# Altium schematic sheet 20210515-F103CONTROL.SchDoc
size A2
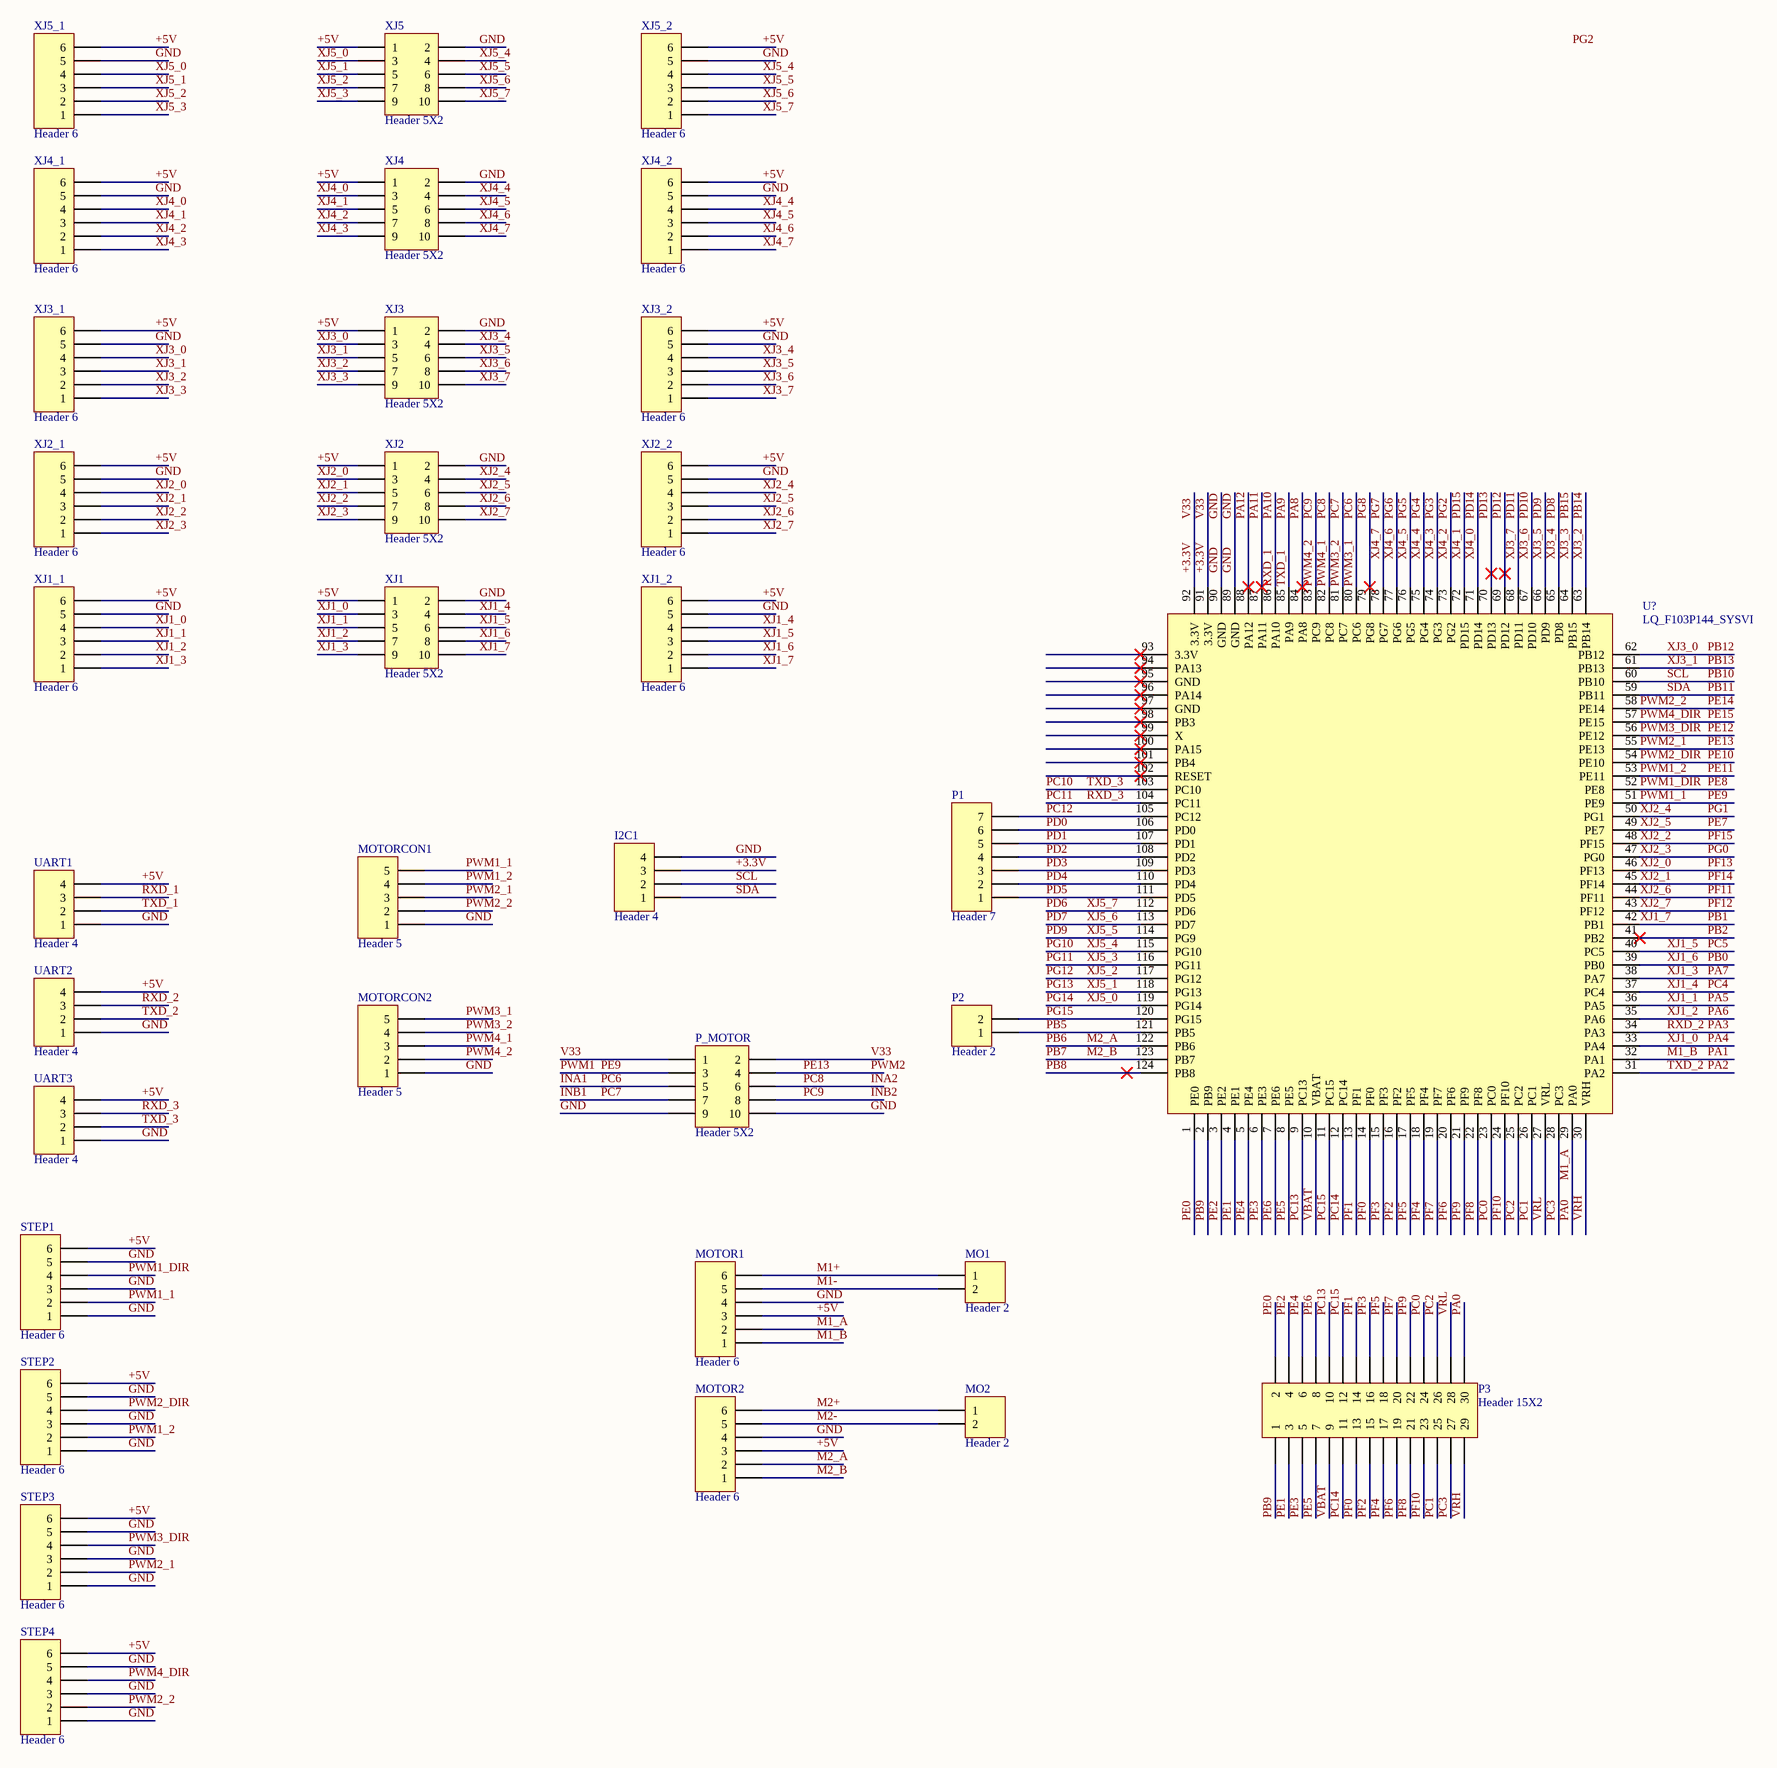
[diagram p0: 20210515-F103CONTROL.SchDoc]

## Parts
I2C1  Header 4  [HDR1X4]
MO1  Header 2  [XH2/2.54mm/180]
MO2  Header 2  [XH2/2.54mm/180]
MOTOR1  Header 6  [HDR1X6]
MOTOR2  Header 6  [HDR1X6]
MOTORCON1  Header 5  [HDR1X5]
MOTORCON2  Header 5  [HDR1X5]
P1  Header 7  [HDR1X7]
P2  Header 2  [HDR1X2]
P3  Header 15X2  [HDR2X15]
P_MOTOR  Header 5X2  [HDR2X5]
STEP1  Header 6  [XH6/2.54mm/180]
STEP2  Header 6  [XH6/2.54mm/180]
STEP3  Header 6  [XH6/2.54mm/180]
STEP4  Header 6  [XH6/2.54mm/180]
U?  LQ_F103P144_SYSVI  [LQ_F103P144_SYSVI]
UART1  Header 4  [XH4/2.54mm/180]
UART2  Header 4  [XH4/2.54mm/180]
UART3  Header 4  [XH4/2.54mm/180]
XJ1  Header 5X2  [HDR2X5]
XJ1_1  Header 6  [PH2.0-6P]
XJ1_2  Header 6  [PH2.0-6P]
XJ2  Header 5X2  [HDR2X5]
XJ2_1  Header 6  [PH2.0-6P]
XJ2_2  Header 6  [PH2.0-6P]
XJ3  Header 5X2  [HDR2X5]
XJ3_1  Header 6  [PH2.0-6P]
XJ3_2  Header 6  [PH2.0-6P]
XJ4  Header 5X2  [HDR2X5]
XJ4_1  Header 6  [PH2.0-6P]
XJ4_2  Header 6  [PH2.0-6P]
XJ5  Header 5X2  [HDR2X5]
XJ5_1  Header 6  [PH2.0-6P]
XJ5_2  Header 6  [PH2.0-6P]

## Nets
+3.3V: I2C1.3 P_MOTOR.1 P_MOTOR.2 U?.91(3.3V) U?.92(3.3V)  [also labelled V33]
+5V: MOTOR1.3 MOTOR2.3 STEP1.6 STEP2.6 STEP3.6 STEP4.6 UART1.4 UART2.4 UART3.4 XJ1.1 XJ1_1.6 XJ1_2.6 XJ2.1 XJ2_1.6 XJ2_2.6 XJ3.1 XJ3_1.6 XJ3_2.6 XJ4.1 XJ4_1.6 XJ4_2.6 XJ5.1 XJ5_1.6 XJ5_2.6
GND: I2C1.4 MOTOR1.4 MOTOR2.4 MOTORCON1.1 MOTORCON2.1 P_MOTOR.9 P_MOTOR.10 STEP1.1 STEP1.3 STEP1.5 STEP2.1 STEP2.3 STEP2.5 STEP3.1 STEP3.3 STEP3.5 STEP4.1 STEP4.3 STEP4.5 U?.89(GND) U?.90(GND) UART1.1 UART2.1 UART3.1 XJ1.2 XJ1_1.5 XJ1_2.5 XJ2.2 XJ2_1.5 XJ2_2.5 XJ3.2 XJ3_1.5 XJ3_2.5 XJ4.2 XJ4_1.5 XJ4_2.5 XJ5.2 XJ5_1.5 XJ5_2.5
INA1: MOTORCON2.5 P_MOTOR.5 U?.80(PC6)  [also labelled PC6, PWM3_1]
INA2: MOTORCON2.3 P_MOTOR.6 U?.82(PC8)  [also labelled PC8, PWM4_1]
INB1: MOTORCON2.4 P_MOTOR.7 U?.81(PC7)  [also labelled PC7, PWM3_2]
INB2: MOTORCON2.2 P_MOTOR.8 U?.83(PC9)  [also labelled PC9, PWM4_2]
M1+: MO1.1 MOTOR1.6
M1-: MO1.2 MOTOR1.5
M1_A: MOTOR1.2 P3.30 U?.29(PA0)  [also labelled PA0]
M1_B: MOTOR1.1 U?.32(PA1)  [also labelled PA1]
M2+: MO2.1 MOTOR2.6
M2-: MO2.2 MOTOR2.5
M2_A: MOTOR2.2 U?.122(PB6)  [also labelled PB6]
M2_B: MOTOR2.1 U?.123(PB7)  [also labelled PB7]
PA2: U?.31(PA2) UART2.2  [also labelled TXD_2]
PA3: U?.34(PA3) UART2.3  [also labelled RXD_2]
PA4: U?.33(PA4) XJ1.3 XJ1_1.4  [also labelled XJ1_0]
PA5: U?.36(PA5) XJ1.5 XJ1_1.3  [also labelled XJ1_1]
PA6: U?.35(PA6) XJ1.7 XJ1_1.2  [also labelled XJ1_2]
PA7: U?.38(PA7) XJ1.9 XJ1_1.1  [also labelled XJ1_3]
PA8: U?.84(PA8)
PA9: U?.85(PA9) UART1.2  [also labelled TXD_1]
PA10: U?.86(PA10) UART1.3  [also labelled RXD_1]
PA11: U?.87(PA11)
PA12: U?.88(PA12)
PB0: U?.39(PB0) XJ1.8 XJ1_2.2  [also labelled XJ1_6]
PB1: U?.42(PB1) XJ1.10 XJ1_2.1  [also labelled XJ1_7]
PB2: U?.41(PB2)
PB5: P2.1 U?.121(PB5)
PB8: U?.124(PB8)
PB9: P3.1 U?.2(PB9)
PB10: I2C1.2 U?.60(PB10)  [also labelled SCL]
PB11: I2C1.1 U?.59(PB11)  [also labelled SDA]
PB12: U?.62(PB12) XJ3.3 XJ3_1.4  [also labelled XJ3_0]
PB13: U?.61(PB13) XJ3.5 XJ3_1.3  [also labelled XJ3_1]
PB14: U?.63(PB14) XJ3.7 XJ3_1.2  [also labelled XJ3_2]
PB15: U?.64(PB15) XJ3.9 XJ3_1.1  [also labelled XJ3_3]
PC0: P3.24 U?.23(PC0)
PC1: P3.25 U?.26(PC1)
PC2: P3.26 U?.25(PC2)
PC3: P3.27 U?.28(PC3)
PC4: U?.37(PC4) XJ1.4 XJ1_2.4  [also labelled XJ1_4]
PC5: U?.40(PC5) XJ1.6 XJ1_2.3  [also labelled XJ1_5]
PC10: U?.103(PC10) UART3.2  [also labelled TXD_3]
PC11: U?.104(PC11) UART3.3  [also labelled RXD_3]
PC12: P1.7 U?.105(PC12)
PC13: P3.10 U?.9(PC13)
PC14: P3.11 U?.12(PC14)
PC15: P3.12 U?.11(PC15)
PD0: P1.6 U?.106(PD0)
PD1: P1.5 U?.107(PD1)
PD2: P1.4 U?.108(PD2)
PD3: P1.3 U?.109(PD3)
PD4: P1.2 U?.110(PD4)
PD5: P1.1 U?.111(PD5)
PD6: U?.112(PD6) XJ5.10 XJ5_2.1  [also labelled XJ5_7]
PD7: U?.113(PD7) XJ5.8 XJ5_2.2  [also labelled XJ5_6]
PD8: U?.65(PD8) XJ3.4 XJ3_2.4  [also labelled XJ3_4]
PD9: U?.66(PD9) U?.114(PG9) XJ3.6 XJ3_2.3 XJ5.6 XJ5_2.3  [also labelled XJ3_5, XJ5_5]
PD10: U?.67(PD10) XJ3.8 XJ3_2.2  [also labelled XJ3_6]
PD11: U?.68(PD11) XJ3.10 XJ3_2.1  [also labelled XJ3_7]
PD12: U?.69(PD12)
PD13: U?.70(PD13)
PD14: U?.71(PD14) XJ4.3 XJ4_1.4  [also labelled XJ4_0]
PD15: U?.72(PD15) XJ4.5 XJ4_1.3  [also labelled XJ4_1]
PE0: P3.2 U?.1(PE0)
PE1: P3.3 U?.4(PE1)
PE2: P3.4 U?.3(PE2)
PE3: P3.5 U?.6(PE3)
PE4: P3.6 U?.5(PE4)
PE5: P3.7 U?.8(PE5)
PE6: P3.8 U?.7(PE6)
PE7: U?.49(PE7) XJ2.6 XJ2_2.3  [also labelled XJ2_5]
PE8: STEP1.4 U?.52(PE8)  [also labelled PWM1_DIR]
PE9: MOTORCON1.5 P_MOTOR.3 STEP1.2 U?.51(PE9)  [also labelled PWM1, PWM1_1]
PE10: STEP2.4 U?.54(PE10)  [also labelled PWM2_DIR]
PE11: MOTORCON1.4 STEP2.2 U?.53(PE11)  [also labelled PWM1_2]
PE12: STEP3.4 U?.56(PE12)  [also labelled PWM3_DIR]
PE13: MOTORCON1.3 P_MOTOR.4 STEP3.2 U?.55(PE13)  [also labelled PWM2, PWM2_1]
PE14: MOTORCON1.2 STEP4.2 U?.58(PE14)  [also labelled PWM2_2]
PE15: STEP4.4 U?.57(PE15)  [also labelled PWM4_DIR]
PF0: P3.13 U?.14(PF0)
PF1: P3.14 U?.13(PF1)
PF2: P3.15 U?.16(PF2)
PF3: P3.16 U?.15(PF3)
PF4: P3.17 U?.18(PF4)
PF5: P3.18 U?.17(PF5)
PF6: P3.19 U?.20(PF6)
PF7: P3.20 U?.19(PF7)
PF8: P3.21 U?.22(PF8)
PF9: P3.22 U?.21(PF9)
PF10: P3.23 U?.24(PF10)
PF11: U?.44(PF11) XJ2.8 XJ2_2.2  [also labelled XJ2_6]
PF12: U?.43(PF12) XJ2.10 XJ2_2.1  [also labelled XJ2_7]
PF13: U?.46(PF13) XJ2.3 XJ2_1.4  [also labelled XJ2_0]
PF14: U?.45(PF14) XJ2.5 XJ2_1.3  [also labelled XJ2_1]
PF15: U?.48(PF15) XJ2.7 XJ2_1.2  [also labelled XJ2_2]
PG0: U?.47(PG0) XJ2.9 XJ2_1.1  [also labelled XJ2_3]
PG1: U?.50(PG1) XJ2.4 XJ2_2.4  [also labelled XJ2_4]
PG2: U?.73(PG2) XJ4.7 XJ4_1.2  [also labelled XJ4_2]
PG3: U?.74(PG3) XJ4.9 XJ4_1.1  [also labelled XJ4_3]
PG4: U?.75(PG4) XJ4.4 XJ4_2.4  [also labelled XJ4_4]
PG5: U?.76(PG5) XJ4.6 XJ4_2.3  [also labelled XJ4_5]
PG6: U?.77(PG6) XJ4.8 XJ4_2.2  [also labelled XJ4_6]
PG7: U?.78(PG7) XJ4.10 XJ4_2.1  [also labelled XJ4_7]
PG8: U?.79(PG8)
PG10: U?.115(PG10) XJ5.4 XJ5_2.4  [also labelled XJ5_4]
PG11: U?.116(PG11) XJ5.9 XJ5_1.1  [also labelled XJ5_3]
PG12: U?.117(PG12) XJ5.7 XJ5_1.2  [also labelled XJ5_2]
PG13: U?.118(PG13) XJ5.5 XJ5_1.3  [also labelled XJ5_1]
PG14: U?.119(PG14) XJ5.3 XJ5_1.4  [also labelled XJ5_0]
PG15: P2.2 U?.120(PG15)
VBAT: P3.9 U?.10(VBAT)
VRH: P3.29 U?.30(VRH)
VRL: P3.28 U?.27(VRL)

Not connected (* = marked no-connect by the designer): U? 93(3.3V)* 94(PA13)* 95(GND)* 96(PA14)* 97(GND)* 98(PB3)* 99(X)* 100(PA15)* 101(PB4)* 102(RESET)*

## Notes on the sheet
- Labels drawn without touching a wire or pin: PG2

## Library data of the parts
I2C1 UART1-UART3 = Header 4: Header, 4-Pin; LatestRevisionDate: 17-Jul-2002; LatestRevisionNote: Re-released for DXP Platform.; Publisher: Altium Limited
MO1 MO2 P2 = Header 2: Header, 2-Pin; LatestRevisionDate: 17-Jul-2002; LatestRevisionNote: Re-released for DXP Platform.; Publisher: Altium Limited
MOTOR1 MOTOR2 STEP1-STEP4 XJ1_1 XJ1_2 XJ2_1 XJ2_2 XJ3_1 XJ3_2 XJ4_1 XJ4_2 XJ5_1 XJ5_2 = Header 6: Header, 6-Pin; LatestRevisionDate: 17-Jul-2002; LatestRevisionNote: Re-released for DXP Platform.; Publisher: Altium Limited
MOTORCON1 MOTORCON2 = Header 5: Header, 5-Pin; LatestRevisionDate: 17-Jul-2002; LatestRevisionNote: Re-released for DXP Platform.; Publisher: Altium Limited
P1 = Header 7: Header, 7-Pin; LatestRevisionDate: 17-Jul-2002; LatestRevisionNote: Re-released for DXP Platform.; Publisher: Altium Limited
P3 = Header 15X2: Header, 15-Pin, Dual row; LatestRevisionDate: 17-Jul-2002; LatestRevisionNote: Re-released for DXP Platform.; Publisher: Altium Limited
P_MOTOR XJ1-XJ5 = Header 5X2: Header, 5-Pin, Dual row; LatestRevisionDate: 17-Jul-2002; LatestRevisionNote: Re-released for DXP Platform.; Publisher: Altium Limited